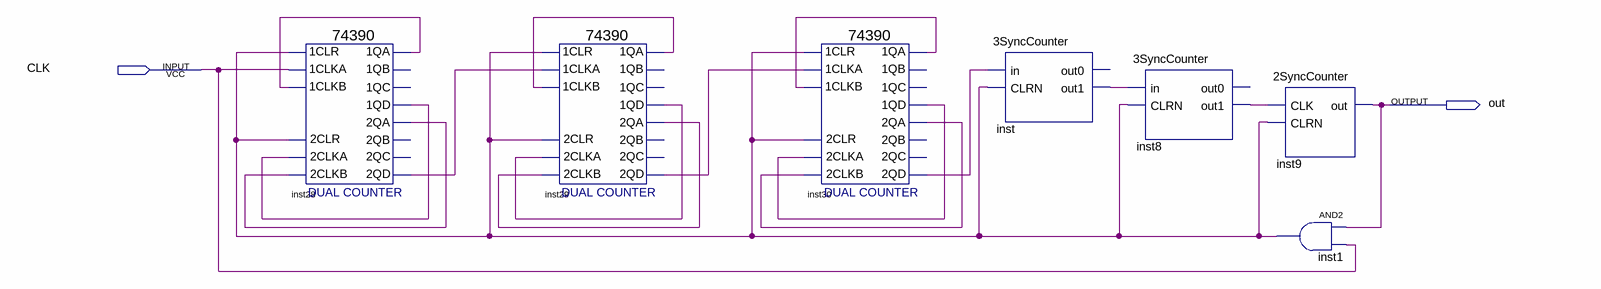
[diagram p0: schematic sheet]
// Quartus schematic WaitDisplay.bdf as structural Verilog: 7 symbols, 2 pins
module WaitDisplay (
  input  CLK,
  output out
);

  wire inst1_out, inst8_out1, inst28_1qa, inst28_1qd, inst28_2qa, inst28_2qd, inst29_1qa, inst29_1qd,
       inst29_2qa, inst29_2qd, inst30_1qa, inst30_1qd, inst30_2qa, inst30_2qd, inst_out1;

  \74390  inst28 (
    .\2CLKA (inst28_1qd), .\2CLR (inst1_out), .\2CLKB (inst28_2qa), .\1CLR (inst1_out), .\1CLKA (CLK),
    .\1CLKB (inst28_1qa), .\1QA (inst28_1qa), .\1QD (inst28_1qd), .\2QA (inst28_2qa), .\2QD (inst28_2qd));  // open: 1QB, 1QC, 2QB, 2QC
  \74390  inst29 (
    .\2CLKA (inst29_1qd), .\2CLR (inst1_out), .\2CLKB (inst29_2qa), .\1CLR (inst1_out), .\1CLKA (inst28_2qd),
    .\1CLKB (inst29_1qa), .\1QA (inst29_1qa), .\1QD (inst29_1qd), .\2QA (inst29_2qa), .\2QD (inst29_2qd));  // open: 1QB, 1QC, 2QB, 2QC
  \74390  inst30 (
    .\2CLKA (inst30_1qd), .\2CLR (inst1_out), .\2CLKB (inst30_2qa), .\1CLR (inst1_out), .\1CLKA (inst29_2qd),
    .\1CLKB (inst30_1qa), .\1QA (inst30_1qa), .\1QD (inst30_1qd), .\2QA (inst30_2qa), .\2QD (inst30_2qd));  // open: 1QB, 1QC, 2QB, 2QC
  \3SyncCounter  inst (.in(inst30_2qd), .CLRN(inst1_out), .out1(inst_out1));  // open: out0
  \3SyncCounter  inst8 (.in(inst_out1), .CLRN(inst1_out), .out1(inst8_out1));  // open: out0
  \2SyncCounter  inst9 (.CLK(inst8_out1), .CLRN(inst1_out), .out(out));
  and inst1 (inst1_out, out, CLK);
endmodule
